# Altium schematic sheet FPGA_board.SchDoc
size A4
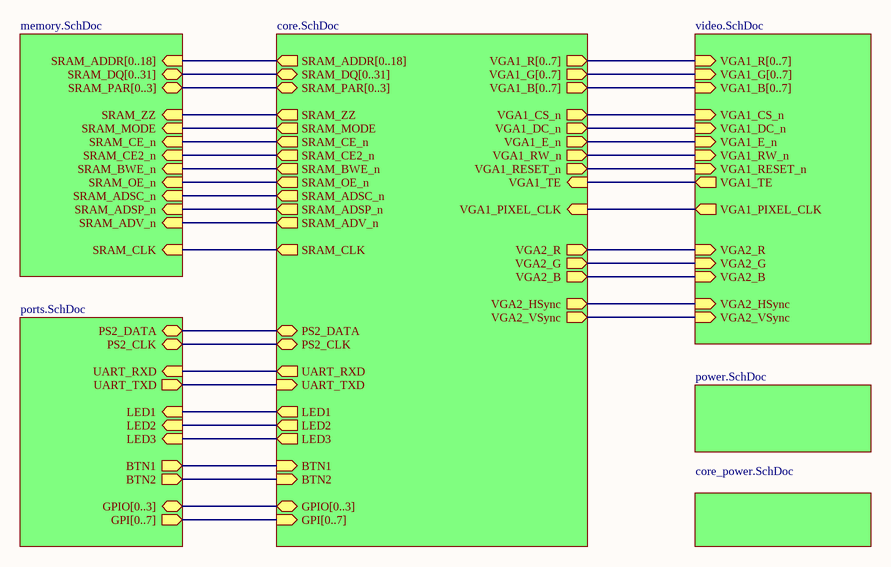
[diagram p0: FPGA_board.SchDoc]

## Sub-sheets
Designator = core.SchDoc: SRAM_ADDR[0..18] (out), SRAM_DQ[0..31] (bidir), SRAM_PAR[0..3] (bidir), VGA1_R[0..7] (out), VGA1_G[0..7] (out), VGA1_B[0..7] (out), GPIO[0..3] (bidir), PS2_DATA (bidir), PS2_CLK (bidir), VGA1_PIXEL_CLK (in), VGA1_RESET_n (out), VGA1_CS_n (out), SRAM_ZZ (out), VGA1_TE (in), VGA1_E_n (out), VGA1_RW_n (out), VGA1_DC_n (out), BTN1 (in), BTN2 (in), LED1 (out), LED2 (out), LED3 (out), VGA2_R (out), VGA2_G (out), VGA2_B (out), VGA2_HSync (out), VGA2_VSync (out), SRAM_MODE (out), SRAM_CLK (out), SRAM_CE_n (out), SRAM_CE2_n (out), SRAM_BWE_n (out), SRAM_OE_n (out), SRAM_ADSC_n (out), SRAM_ADSP_n (out), SRAM_ADV_n (out), UART_RXD (out), UART_TXD (in), GPI[0..7] (in)
Designator = video.SchDoc: VGA1_R[0..7] (in), VGA1_G[0..7] (in), VGA1_B[0..7] (in), VGA1_CS_n (in), VGA1_DC_n (in), VGA1_RW_n (in), VGA1_E_n (in), VGA1_RESET_n (in), VGA1_TE (out), VGA1_PIXEL_CLK (out), VGA2_G (in), VGA2_B (in), VGA2_VSync (in), VGA2_HSync (in), VGA2_R (in)
Designator = ports.SchDoc: BTN1 (out), BTN2 (out), PS2_DATA (bidir), PS2_CLK (bidir), UART_RXD (in), UART_TXD (out), LED1 (in), LED2 (in), LED3 (in), GPIO[0..3] (bidir), GPI[0..7] (out)
Designator = power.SchDoc: no entries
Designator = memory.SchDoc: SRAM_ADDR[0..18] (in), SRAM_DQ[0..31] (bidir), SRAM_PAR[0..3] (bidir), SRAM_ZZ (in), SRAM_MODE (in), SRAM_CLK (in), SRAM_CE_n (in), SRAM_CE2_n (in), SRAM_BWE_n (in), SRAM_OE_n (in), SRAM_ADSC_n (in), SRAM_ADSP_n (in), SRAM_ADV_n (in)
Designator = core_power.SchDoc: no entries

## Nets
(unnamed): sheet Designator/PS2_DATA, sheet Designator/PS2_DATA
(unnamed): sheet Designator/PS2_CLK, sheet Designator/PS2_CLK
(unnamed): sheet Designator/VGA1_PIXEL_CLK, sheet Designator/VGA1_PIXEL_CLK
(unnamed): sheet Designator/VGA1_RESET_n, sheet Designator/VGA1_RESET_n
(unnamed): sheet Designator/VGA1_CS_n, sheet Designator/VGA1_CS_n
(unnamed): sheet Designator/SRAM_ZZ, sheet Designator/SRAM_ZZ
(unnamed): sheet Designator/VGA1_TE, sheet Designator/VGA1_TE
(unnamed): sheet Designator/VGA1_E_n, sheet Designator/VGA1_E_n
(unnamed): sheet Designator/VGA1_RW_n, sheet Designator/VGA1_RW_n
(unnamed): sheet Designator/VGA1_DC_n, sheet Designator/VGA1_DC_n
(unnamed): sheet Designator/BTN1, sheet Designator/BTN1
(unnamed): sheet Designator/BTN2, sheet Designator/BTN2
(unnamed): sheet Designator/LED1, sheet Designator/LED1
(unnamed): sheet Designator/LED2, sheet Designator/LED2
(unnamed): sheet Designator/LED3, sheet Designator/LED3
(unnamed): sheet Designator/VGA2_R, sheet Designator/VGA2_R
(unnamed): sheet Designator/VGA2_G, sheet Designator/VGA2_G
(unnamed): sheet Designator/VGA2_B, sheet Designator/VGA2_B
(unnamed): sheet Designator/VGA2_HSync, sheet Designator/VGA2_HSync
(unnamed): sheet Designator/VGA2_VSync, sheet Designator/VGA2_VSync
(unnamed): sheet Designator/SRAM_MODE, sheet Designator/SRAM_MODE
(unnamed): sheet Designator/SRAM_CLK, sheet Designator/SRAM_CLK
(unnamed): sheet Designator/SRAM_CE_n, sheet Designator/SRAM_CE_n
(unnamed): sheet Designator/SRAM_CE2_n, sheet Designator/SRAM_CE2_n
(unnamed): sheet Designator/SRAM_BWE_n, sheet Designator/SRAM_BWE_n
(unnamed): sheet Designator/SRAM_OE_n, sheet Designator/SRAM_OE_n
(unnamed): sheet Designator/SRAM_ADSC_n, sheet Designator/SRAM_ADSC_n
(unnamed): sheet Designator/SRAM_ADSP_n, sheet Designator/SRAM_ADSP_n
(unnamed): sheet Designator/SRAM_ADV_n, sheet Designator/SRAM_ADV_n
(unnamed): sheet Designator/UART_RXD, sheet Designator/UART_RXD
(unnamed): sheet Designator/UART_TXD, sheet Designator/UART_TXD